# EAGLE design robo_mantis (EAGLE 9.2.2)
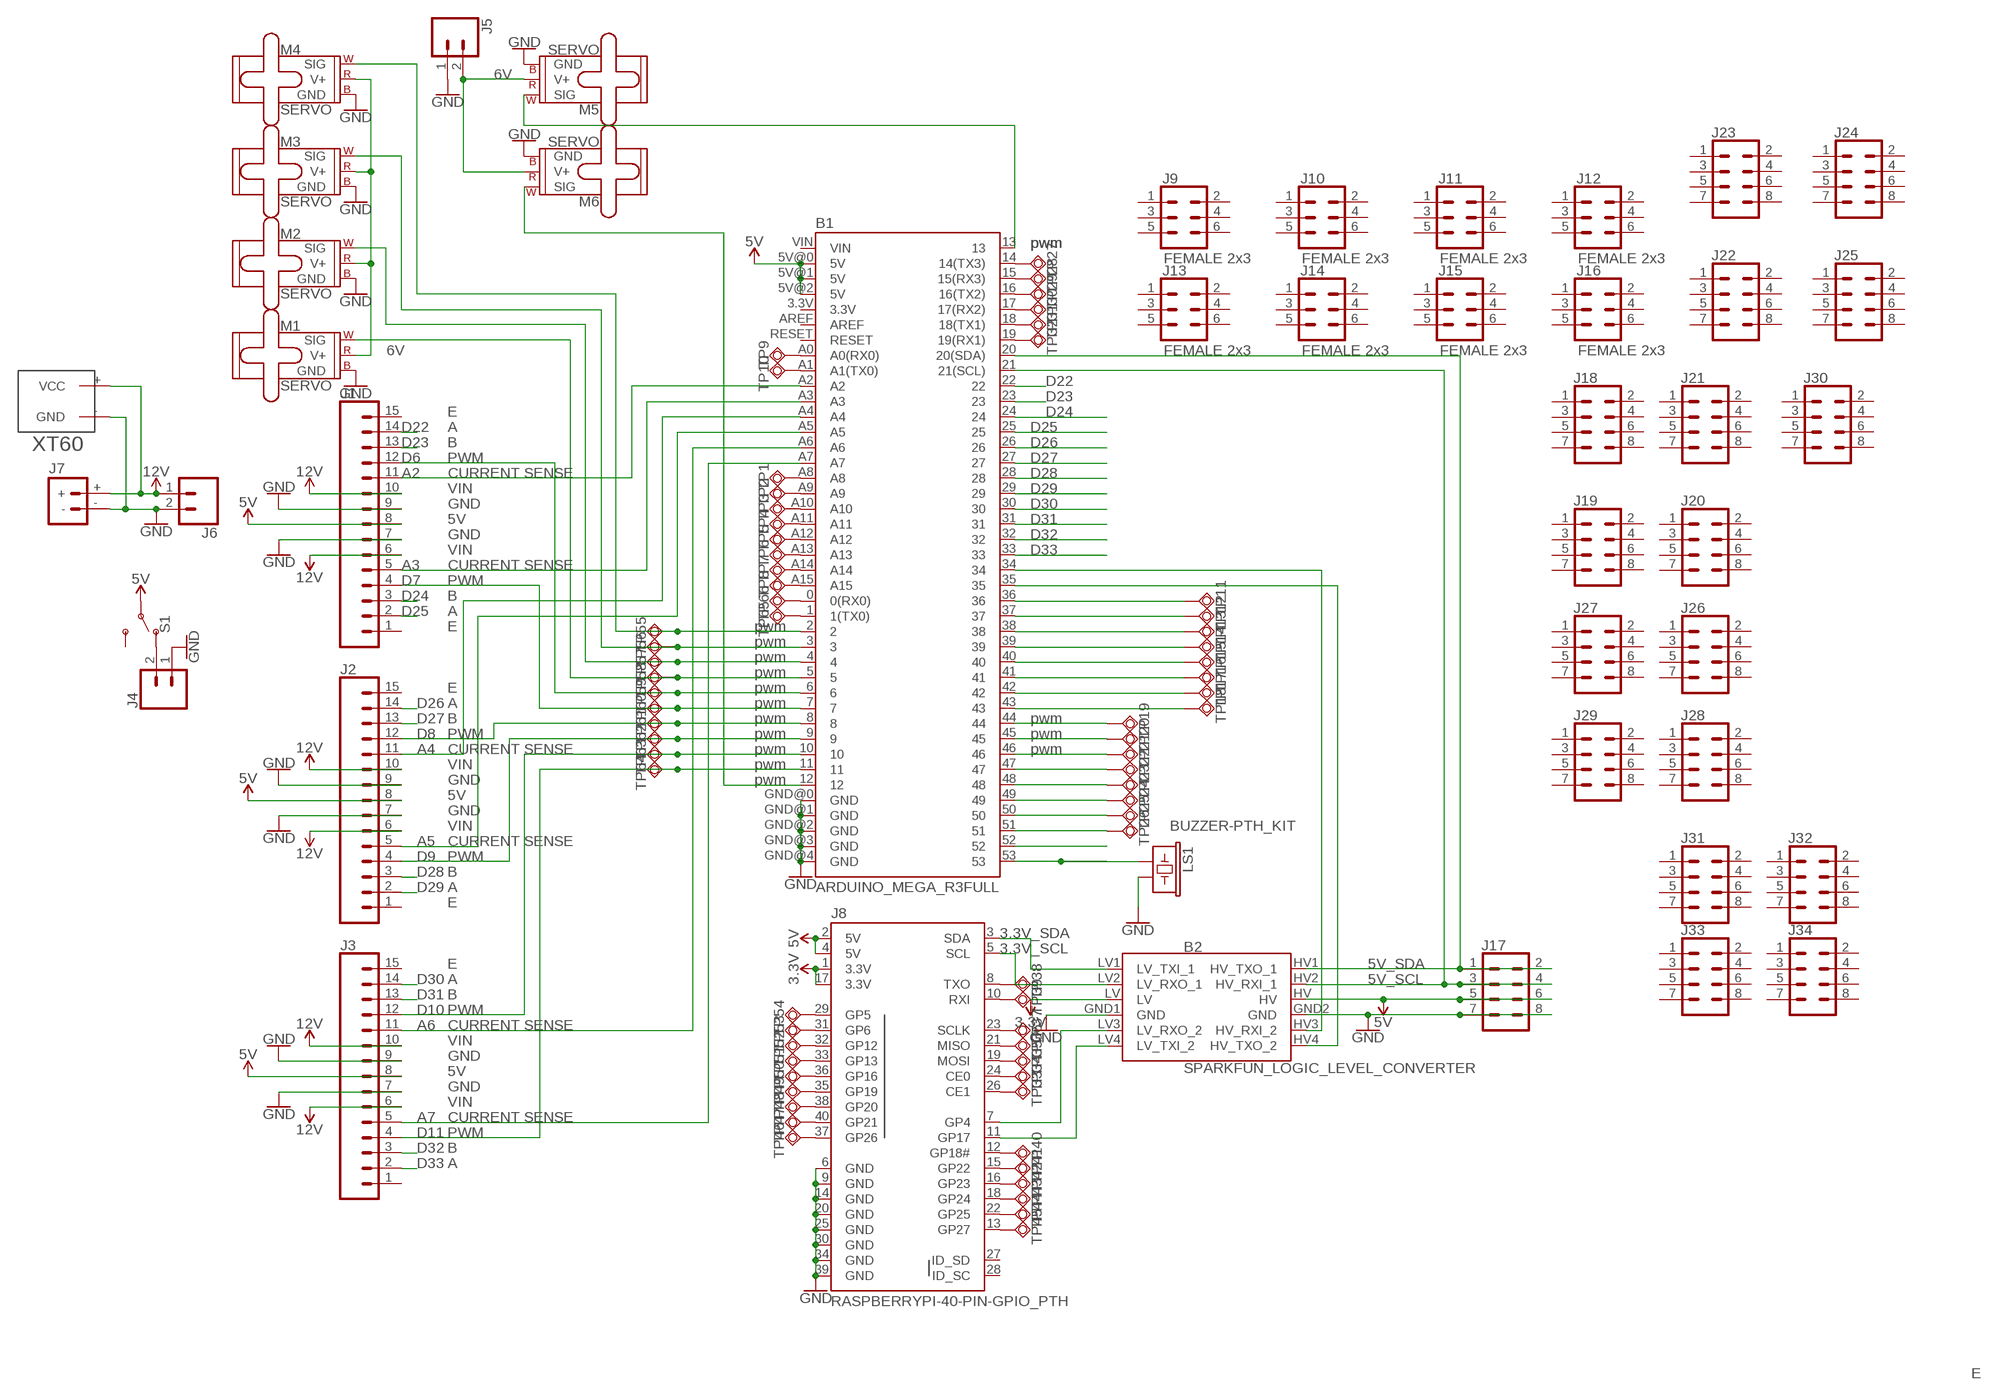
[diagram p0: schematic, sheet 1]

## Parts
B1  ARDUINO_MEGA_R3FULL  [ARDUINO_MEGA]
B2  SPARKFUN_LOGIC_LEVEL_CONVERTER  [SPARKFUN_LOGIC_LEVEL_CONVERTER]
J1  CONN_15LOCK_LONGPADS  [1X15_LOCK_LONGPADS]
J2  CONN_15LOCK_LONGPADS  [1X15_LOCK_LONGPADS]
J3  CONN_15LOCK_LONGPADS  [1X15_LOCK_LONGPADS]
J4  CONN_02  [1X02]
J5  CONN_02  [1X02]
J6  CONN_02  [1X02]
J7  BATTERY_CONN_DEANS  [DEANS]
J8  RASPBERRYPI-40-PIN-GPIO_PTH  [2X20_SHROUDED]
J9  FEMALE 2x3  CONN_03X2FEMALE  [2X3]
J10  FEMALE 2x3  CONN_03X2FEMALE  [2X3]
J11  FEMALE 2x3  CONN_03X2FEMALE  [2X3]
J12  FEMALE 2x3  CONN_03X2FEMALE  [2X3]
J13  FEMALE 2x3  CONN_03X2FEMALE  [2X3]
J14  FEMALE 2x3  CONN_03X2FEMALE  [2X3]
J15  FEMALE 2x3  CONN_03X2FEMALE  [2X3]
J16  FEMALE 2x3  CONN_03X2FEMALE  [2X3]
J17  CONN_04X2  [2X4]
J18  CONN_04X2  [2X4]
J19  CONN_04X2  [2X4]
J20  CONN_04X2  [2X4]
J21  CONN_04X2  [2X4]
J22  CONN_04X2  [2X4]
J23  CONN_04X2  [2X4]
J24  CONN_04X2  [2X4]
J25  CONN_04X2  [2X4]
J26  CONN_04X2  [2X4]
J27  CONN_04X2  [2X4]
J28  CONN_04X2  [2X4]
J29  CONN_04X2  [2X4]
J30  CONN_04X2  [2X4]
J31  CONN_04X2  [2X4]
J32  CONN_04X2  [2X4]
J33  CONN_04X2  [2X4]
J34  CONN_04X2  [2X4]
LS1  BUZZER-PTH_KIT  [BUZZER-12MM-KIT]
M1  SERVO  [1X03]
M2  SERVO  [1X03]
M3  SERVO  [1X03]
M4  SERVO  [1X03]
M5  SERVO  [1X03]
M6  SERVO  [1X03]
S1  SWITCH-SPDT-PTH-11.6X4.0MM-LOCK  [SWITCH_SPDT_PTH_11.6X4.0MM_LOCK]
TP1  TESTPAD_TPSQB1,27  [TESTPAD_B1,27]
TP2  TESTPAD_TPSQB1,27  [TESTPAD_B1,27]
TP3  TESTPAD_TPSQB1,27  [TESTPAD_B1,27]
TP4  TESTPAD_TPSQB1,27  [TESTPAD_B1,27]
TP5  TESTPAD_TPSQB1,27  [TESTPAD_B1,27]
TP6  TESTPAD_TPSQB1,27  [TESTPAD_B1,27]
TP7  TESTPAD_TPSQB1,27  [TESTPAD_B1,27]
TP8  TESTPAD_TPSQB1,27  [TESTPAD_B1,27]
TP9  TESTPAD_TPSQB1,27  [TESTPAD_B1,27]
TP10  TESTPAD_TPSQB1,27  [TESTPAD_B1,27]
TP11  TESTPAD_TPSQB1,27  [TESTPAD_B1,27]
TP12  TESTPAD_TPSQB1,27  [TESTPAD_B1,27]
TP13  TESTPAD_TPSQB1,27  [TESTPAD_B1,27]
TP14  TESTPAD_TPSQB1,27  [TESTPAD_B1,27]
TP15  TESTPAD_TPSQB1,27  [TESTPAD_B1,27]
TP16  TESTPAD_TPSQB1,27  [TESTPAD_B1,27]
TP17  TESTPAD_TPSQB1,27  [TESTPAD_B1,27]
TP18  TESTPAD_TPSQB1,27  [TESTPAD_B1,27]
TP19  TESTPAD_TPSQB1,27  [TESTPAD_B1,27]
TP20  TESTPAD_TPSQB1,27  [TESTPAD_B1,27]
TP21  TESTPAD_TPSQB1,27  [TESTPAD_B1,27]
TP22  TESTPAD_TPSQB1,27  [TESTPAD_B1,27]
TP23  TESTPAD_TPSQB1,27  [TESTPAD_B1,27]
TP24  TESTPAD_TPSQB1,27  [TESTPAD_B1,27]
TP25  TESTPAD_TPSQB1,27  [TESTPAD_B1,27]
TP26  TESTPAD_TPSQB1,27  [TESTPAD_B1,27]
TP27  TESTPAD_TPSQB1,27  [TESTPAD_B1,27]
TP28  TESTPAD_TPSQB1,27  [TESTPAD_B1,27]
TP29  TESTPAD_TPSQB1,27  [TESTPAD_B1,27]
TP30  TESTPAD_TPSQB1,27  [TESTPAD_B1,27]
TP31  TESTPAD_TPSQB1,27  [TESTPAD_B1,27]
TP32  TESTPAD_TPSQB1,27  [TESTPAD_B1,27]
TP33  TESTPAD_TPSQB1,27  [TESTPAD_B1,27]
TP34  TESTPAD_TPSQB1,27  [TESTPAD_B1,27]
TP35  TESTPAD_TPSQB1,27  [TESTPAD_B1,27]
TP36  TESTPAD_TPSQB1,27  [TESTPAD_B1,27]
TP37  TESTPAD_TPSQB1,27  [TESTPAD_B1,27]
TP38  TESTPAD_TPSQB1,27  [TESTPAD_B1,27]
TP39  TESTPAD_TPSQB1,27  [TESTPAD_B1,27]
TP40  TESTPAD_TPSQB1,27  [TESTPAD_B1,27]
TP41  TESTPAD_TPSQB1,27  [TESTPAD_B1,27]
TP42  TESTPAD_TPSQB1,27  [TESTPAD_B1,27]
TP43  TESTPAD_TPSQB1,27  [TESTPAD_B1,27]
TP44  TESTPAD_TPSQB1,27  [TESTPAD_B1,27]
TP45  TESTPAD_TPSQB1,27  [TESTPAD_B1,27]
TP46  TESTPAD_TPSQB1,27  [TESTPAD_B1,27]
TP47  TESTPAD_TPSQB1,27  [TESTPAD_B1,27]
TP48  TESTPAD_TPSQB1,27  [TESTPAD_B1,27]
TP49  TESTPAD_TPSQB1,27  [TESTPAD_B1,27]
TP50  TESTPAD_TPSQB1,27  [TESTPAD_B1,27]
TP51  TESTPAD_TPSQB1,27  [TESTPAD_B1,27]
TP52  TESTPAD_TPSQB1,27  [TESTPAD_B1,27]
TP53  TESTPAD_TPSQB1,27  [TESTPAD_B1,27]
TP54  TESTPAD_TPSQB1,27  [TESTPAD_B1,27]
TP55  TESTPAD_TPSQB1,27  [TESTPAD_B1,27]
TP56  TESTPAD_TPSQB1,27  [TESTPAD_B1,27]
TP57  TESTPAD_TPSQB1,27  [TESTPAD_B1,27]
TP58  TESTPAD_TPSQB1,27  [TESTPAD_B1,27]
TP59  TESTPAD_TPSQB1,27  [TESTPAD_B1,27]
TP60  TESTPAD_TPSQB1,27  [TESTPAD_B1,27]
TP61  TESTPAD_TPSQB1,27  [TESTPAD_B1,27]
TP62  TESTPAD_TPSQB1,27  [TESTPAD_B1,27]
TP63  TESTPAD_TPSQB1,27  [TESTPAD_B1,27]
TP64  TESTPAD_TPSQB1,27  [TESTPAD_B1,27]
TP65  TESTPAD_TPSQB1,27  [TESTPAD_B1,27]
TP66  TESTPAD_TPSQB1,27  [TESTPAD_B1,27]
U$1  XT60  [XT60]

## Nets
3.3V: B2.LV J8.1(3.3V) J8.17(3.3V)
3.3V_SCL: B2.LV2(LV_RXO_1) J8.5(SCL)
3.3V_SDA: B2.LV1(LV_TXI_1) J8.3(SDA)
5V: B1.5V@0(5V) B1.5V@1(5V) B1.5V@2(5V) B2.HV J1.8 J2.8 J3.8 J8.2(5V) J8.4(5V) J17.5 J17.6 S1.2(P)
5V_SCL: B1.21(21(SCL)) B2.HV2(HV_RXI_1) J17.3 J17.4
5V_SDA: B1.20(20(SDA)) B2.HV1(HV_TXO_1) J17.1 J17.2
6V: J5.2 M1.2(V+) M2.2(V+) M3.2(V+) M4.2(V+) M5.2(V+) M6.2(V+)
12V: J1.6 J1.10 J2.6 J2.10 J3.6 J3.10 J6.1 J7.+ U$1.+(VCC)
A2: B1.A2 J1.11
A3: B1.A3 J1.5
A4: B1.A4 J2.11
A5: B1.A5 J2.5
A6: B1.A6 J3.11
A7: B1.A7 J3.5
BCM4: B2.LV3(LV_RXO_2) J8.7(GP4)
BCM17: B2.LV4(LV_TXI_2) J8.11(GP17)
D2: B1.2 M4.1(SIG) TP55.TP
D3: B1.3 M3.1(SIG) TP56.TP
D4: B1.4 M2.1(SIG) TP57.TP
D5: B1.5 M1.1(SIG) TP58.TP
D6: B1.6 J1.12 TP59.TP
D7: B1.7 J1.4 TP60.TP
D8: B1.8 J2.12 TP61.TP
D9: B1.9 J2.4 TP62.TP
D10: B1.10 J3.12 TP63.TP
D11: B1.11 J3.4 TP64.TP
D12: B1.12 M6.1(SIG)
D13: B1.13 M5.1(SIG)
D22: B1.22 J1.14
D23: B1.23 J1.13
D24: B1.24 J1.3
D25: B1.25 J1.2
D26: B1.26 J2.14
D27: B1.27 J2.13
D28: B1.28 J2.3
D29: B1.29 J2.2
D30: B1.30 J3.14
D31: B1.31 J3.13
D32: B1.32 J3.3
D33: B1.33 J3.2
GND: B1.GND@0(GND) B1.GND@1(GND) B1.GND@2(GND) B1.GND@3(GND) B1.GND@4(GND) B2.GND1(GND) B2.GND2(GND) J1.7 J1.9 J2.7 J2.9 J3.7 J3.9 J4.1 J5.1 J6.2 J7.- J8.6(GND) J8.9(GND) J8.14(GND) J8.20(GND) J8.25(GND) J8.30(GND) J8.34(GND) J8.39(GND) J17.7 J17.8 LS1.- M1.3(GND) M2.3(GND) M3.3(GND) M4.3(GND) M5.3(GND) M6.3(GND) U$1.-(GND)
N$5: B1.44 TP19.TP
N$6: B1.45 TP20.TP
N$8: B1.46 TP21.TP
N$9: B1.47 TP22.TP
N$11: B1.48 TP23.TP
N$12: B1.49 TP24.TP
N$14: B1.50 TP25.TP
N$15: B1.51 TP26.TP
N$17: B1.52
N$18: B1.53 LS1.+
N$23: J4.2 S1.1(O)
N$26: B1.A8 TP1.TP
N$27: B1.A9 TP2.TP
N$28: B1.A10 TP3.TP
N$30: B1.A11 TP4.TP
N$31: B1.A12 TP5.TP
N$33: B1.A13 TP6.TP
N$34: B1.A14 TP7.TP
N$35: B1.34 B2.HV3(HV_RXI_2)
N$36: B1.35 B2.HV4(HV_TXO_2)
N$37: B1.36 TP11.TP
N$38: B1.37 TP12.TP
N$39: B1.38 TP13.TP
N$40: B1.39 TP14.TP
N$41: B1.40 TP15.TP
N$42: B1.41 TP16.TP
N$43: B1.42 TP17.TP
N$44: B1.43 TP18.TP
N$53: B1.A15 TP8.TP
N$54: B1.A0(A0(RX0)) TP9.TP
N$55: B1.A1(A1(TX0)) TP10.TP
N$56: B1.14(14(TX3)) TP27.TP
N$57: B1.15(15(RX3)) TP28.TP
N$58: B1.16(16(TX2)) TP29.TP
N$59: B1.17(17(RX2)) TP30.TP
N$60: B1.18(18(TX1)) TP31.TP
N$61: B1.19(19(RX1)) TP32.TP
N$62: J8.26(CE1) TP33.TP
N$63: J8.24(CE0) TP34.TP
N$64: J8.19(MOSI) TP35.TP
N$65: J8.21(MISO) TP36.TP
N$66: J8.23(SCLK) TP37.TP
N$67: J8.8(TXO) TP38.TP
N$68: J8.10(RXI) TP39.TP
N$69: J8.12(GP18#) TP40.TP
N$70: J8.15(GP22) TP41.TP
N$71: J8.16(GP23) TP42.TP
N$72: J8.18(GP24) TP43.TP
N$73: J8.22(GP25) TP44.TP
N$74: J8.13(GP27) TP45.TP
N$75: J8.37(GP26) TP46.TP
N$76: J8.40(GP21) TP47.TP
N$77: J8.38(GP20) TP48.TP
N$78: J8.35(GP19) TP49.TP
N$79: J8.36(GP16) TP50.TP
N$80: J8.33(GP13) TP51.TP
N$81: J8.32(GP12) TP52.TP
N$82: J8.31(GP6) TP53.TP
N$83: J8.29(GP5) TP54.TP
N$84: B1.1(1(TX0)) TP65.TP
N$85: B1.0(0(RX0)) TP66.TP
Unconnected: B1.3.3V B1.AREF B1.RESET B1.VIN J1.1 J1.15 J2.1 J2.15 J3.1 J3.15 J8.27(ID_SD) J8.28(ID_SC) J9.1 J9.2 J9.3 J9.4 J9.5 J9.6 J10.1 J10.2 J10.3 J10.4 J10.5 J10.6 J11.1 J11.2 J11.3 J11.4 J11.5 J11.6 J12.1 J12.2 J12.3 J12.4 J12.5 J12.6 J13.1 J13.2 J13.3 J13.4 J13.5 J13.6 J14.1 J14.2 J14.3 J14.4 J14.5 J14.6 J15.1 J15.2 J15.3 J15.4 J15.5 J15.6 J16.1 J16.2 J16.3 J16.4 J16.5 J16.6 J18.1 J18.2 J18.3 J18.4 J18.5 J18.6 J18.7 J18.8 J19.1 J19.2 J19.3 J19.4 J19.5 J19.6 J19.7 J19.8 J20.1 J20.2 J20.3 J20.4 J20.5 J20.6 J20.7 J20.8 J21.1 J21.2 J21.3 J21.4 J21.5 J21.6 J21.7 J21.8 J22.1 J22.2 J22.3 J22.4 J22.5 J22.6 J22.7 J22.8 J23.1 J23.2 J23.3 J23.4 J23.5 J23.6 J23.7 J23.8 J24.1 J24.2 J24.3 J24.4 J24.5 J24.6 J24.7 J24.8 J25.1 J25.2 J25.3 J25.4 J25.5 J25.6 J25.7 J25.8 J26.1 J26.2 J26.3 J26.4 J26.5 J26.6 J26.7 J26.8 J27.1 J27.2 J27.3 J27.4 J27.5 J27.6 J27.7 J27.8 J28.1 J28.2 J28.3 J28.4 J28.5 J28.6 J28.7 J28.8 J29.1 J29.2 J29.3 J29.4 J29.5 J29.6 J29.7 J29.8 J30.1 J30.2 J30.3 J30.4 J30.5 J30.6 J30.7 J30.8 J31.1 J31.2 J31.3 J31.4 J31.5 J31.6 J31.7 J31.8 J32.1 J32.2 J32.3 J32.4 J32.5 J32.6 J32.7 J32.8 J33.1 J33.2 J33.3 J33.4 J33.5 J33.6 J33.7 J33.8 J34.1 J34.2 J34.3 J34.4 J34.5 J34.6 J34.7 J34.8 S1.3(S)

## Notes on the sheet
- pwm | pwm
- E
- A
- B
- PWM
- CURRENT SENSE
- VIN
- GND
- 5V
- GND
- VIN
- CURRENT SENSE
- PWM
- B
- A
- E | pwm
- pwm
- pwm
- pwm
- E | pwm
- A | pwm
- B | pwm | pwm
- PWM | pwm | pwm
- CURRENT SENSE | pwm | pwm
- VIN | pwm
- GND | pwm
- 5V
- GND
- VIN
- CURRENT SENSE
- PWM
- B
- A
- E
- E
- A
- B
- PWM
- CURRENT SENSE
- VIN
- GND
- 5V
- GND
- VIN
- CURRENT SENSE
- PWM
- B
- A
- E

## Library data of the parts
B1 = SparkFun-Boards:ARDUINO_MEGA_R3: Arduino Mega R3 ATmega2560 R3 compatible footprint. SparkFun Products: Arduino Mega 2560 R3 <https://www.sparkfun.com/products/11061>
B2 = SparkFun-Boards:SPARKFUN_LOGIC_LEVEL_CONVERTER: SparkFun Logic Level Converter -Bi-Directional This is the mechnical outline for the 3.3V - 5V bi directional logic level converter. *Note, the "LOCK" Package has the header pins staggered by an offset of 5 mils (off center line), so that when you slide a row of standard 0.1" headers into the PTH pads, it will hold position vertically. See the follwing turorial for more information on this type of special footprints: Sneaky Footprints <https://www.sparkfun.com/tutorials/114> SparkFun Products: SparkFun Logic Level Converter - Bi-Directional <https://www.sparkfun.com/products/12009>
J1-J3 = SparkFun-Connectors:CONN_15: Multi connection point. Often used as Generic Header-pin footprint for 0.1 inch spaced/style header connections On any of the 0.1 inch spaced packages, you can populate with these: Break Away Headers - Straight <https://www.sparkfun.com/products/116> (PRT-00116) Break Away Male Headers - Right Angle <https://www.sparkfun.com/products/553> (PRT-00553) Female Headers <https://www.sparkfun.com/products/115> (PRT-00115) Break Away Headers - Machine Pin <https://www.sparkfun.com/products/117> (PRT-00117) Break Away Female Headers - Swiss Machine Pin <https://www.sparkfun.com/products/743> (PRT-00743) For SCREWTERMINALS and SPRING TERMINALS visit here: Screw Terimnals on SparkFun.com <https://www.sparkfun.com/search/results?term=Screw+Terminals> (5mm/3.5mm/2.54mm spacing) This device is also useful as a general connection point to wire up your design to another part of your project. Our various solder wires solder well into these plated through hole pads. Hook-Up Wire - Assortment (Stranded, 22 AWG) <https://www.sparkfun.com/products/11375> (PRT-11375) Hook-Up Wire - Assortment (Solid Core, 22 AWG) <https://www.sparkfun.com/products/11367> (PRT-11367) View the entire wire category on our website here <https://www.sparkfun.com/categories/141> Special notes: Molex polarized connector foot print use with SKU : PRT-08231 with associated crimp pins and housings. 1MM SMD Version SKU: PRT-10208 NOTES ON THE VARIANTS LOCK and LOCK_LONGPADS... This footprint was designed to help hold the alignment of a through-hole component (i.e. 6-pin header) while soldering it into place. You may notice that each hole has been shifted either up or down by 0.005 of an inch from it's more standard position (which is a perfectly straight line). This slight alteration caused the pins (the squares in the middle) to touch the edges of the holes. Because they are alternating, it causes a "brace" to hold the component in place. 0.005 has proven to be the perfect amount of "off-center" position when using our standard breakaway headers. Although looks a little odd when you look at the bare footprint, once you have a header in there, the alteration is very hard to notice. Also,if you push a header all the way into place, it is covered up entirely on the bottom side.
J4-J6 = SparkFun-Connectors:CONN_02: Multi connection point. Often used as Generic Header-pin footprint for 0.1 inch spaced/style header connections On any of the 0.1 inch spaced packages, you can populate with these: Break Away Headers - Straight <https://www.sparkfun.com/products/116> (PRT-00116) Break Away Male Headers - Right Angle <https://www.sparkfun.com/products/553> (PRT-00553) Female Headers <https://www.sparkfun.com/products/115> (PRT-00115) Break Away Headers - Machine Pin <https://www.sparkfun.com/products/117> (PRT-00117) Break Away Female Headers - Swiss Machine Pin <https://www.sparkfun.com/products/743> (PRT-00743) For SCREWTERMINALS and SPRING TERMINALS visit here: Screw Terimnals on SparkFun.com <https://www.sparkfun.com/search/results?term=Screw+Terminals> (5mm/3.5mm/2.54mm spacing) This device is also useful as a general connection point to wire up your design to another part of your project. Our various solder wires solder well into these plated through hole pads. Hook-Up Wire - Assortment (Stranded, 22 AWG) <https://www.sparkfun.com/products/11375> (PRT-11375) Hook-Up Wire - Assortment (Solid Core, 22 AWG) <https://www.sparkfun.com/products/11367> (PRT-11367) View the entire wire category on our website here <https://www.sparkfun.com/categories/141> Special notes: Molex polarized connector foot print use with: PRT-08233 with associated crimp pins and housings. 2.54_SCREWTERM for use with PRT-10571. 3.5mm Screw Terminal footprints for PRT-08084 5mm Screw Terminal footprints for use with PRT-08432
J7 = SparkFun-Connectors:BATTERY_CONN: Battery Connectors Various footprints for battery connections SparkFun Products: Deans Connector -M/F Pair <https://www.sparkfun.com/products/11864>; SF_ID: PRT-11864
J8 = SparkFun-Connectors:RASPBERRYPI-40-PIN-GPIO: Raspberry Pi GPIO Header 2x20 pin connector, as found on B, B+, A+ models. Both shrouded PTH and SMT versions available. SparkFun Products: GPIO Shrouded Header <https://www.sparkfun.com/products/13054>- PTH SparkFun Pi Wedge (Preassembled) <https://www.sparkfun.com/products/13717>; PROD_ID: CONN-12263; SF_ID: PRT-13054
J9-J16 = SparkFun-Connectors:CONN_03X2: Multi connection point. Often used as Generic Header-pin footprint for 0.1 inch spaced/style header connections You can populate with any combo of single row headers, but if you'd like an exact match, check these: Header - 2x3 (Male, 0.1") <https://www.sparkfun.com/products/12807> (PRT-12807) Header - 2x3 (Female, 0.1") <https://www.sparkfun.com/products/13010> (PRT-13010) 2x3 Pin Shrouded Header <https://www.sparkfun.com/products/10877> (PRT-10877) On any of the 0.1 inch spaced packages, you can populate with these: Break Away Headers - Straight <https://www.sparkfun.com/products/116> (PRT-00116) Break Away Male Headers - Right Angle <https://www.sparkfun.com/products/553> (PRT-00553) Female Headers <https://www.sparkfun.com/products/115> (PRT-00115) Break Away Headers - Machine Pin <https://www.sparkfun.com/products/117> (PRT-00117) Break Away Female Headers - Swiss Machine Pin <https://www.sparkfun.com/products/743> (PRT-00743) Special note: the shrouded connector mates well with our 3x2 ribbon cables: Ribbon Crimp Connector - 6-pin (2x3, Female) <https://www.sparkfun.com/products/10651> (PRT-10651) Ribbon Cable - 6 wire (15ft) <https://www.sparkfun.com/products/10646> (PRT-10646); PROD_ID: CONN-11566
J17-J34 = SparkFun-Connectors:CONN_04X2: Multi connection point. Often used as Generic Header-pin footprint for 0.1 inch spaced/style header connections On any of the 0.1 inch spaced packages, you can populate with these: Break Away Headers - Straight <https://www.sparkfun.com/products/116> (PRT-00116) Break Away Male Headers - Right Angle <https://www.sparkfun.com/products/553> (PRT-00553) Female Headers <https://www.sparkfun.com/products/115> (PRT-00115) Break Away Headers - Machine Pin <https://www.sparkfun.com/products/117> (PRT-00117) Break Away Female Headers - Swiss Machine Pin <https://www.sparkfun.com/products/743> (PRT-00743)
LS1 = SparkFun-Electromechanical:BUZZER: Buzzer Small round buzzers that operate around the audible 2kHz range. You can use these as speakers to create simple music or user interfaces. Variant Overview: PTH - Mini Speaker - PC Mount 12mm 2.048kHz <https://www.sparkfun.com/products/7950> PTH_KIT - Mini Speaker - PC Mount 12mm 2.048kHz <https://www.sparkfun.com/products/7950> KIT simplifies soldering by adding stop mask to one side of the pads. PTH_NO_SILK - Mini Speaker - PC Mount 12mm 2.048kHz <https://www.sparkfun.com/products/7950> No silkscreen indicator of buzzer outline. PTH_KIT_NO_SILK - Mini Speaker - PC Mount 12mm 2.048kHz <https://www.sparkfun.com/products/7950> KIT package w/o silkscreen SMD - Buzzer Audio Magnetic (CCV-084B16) SMD buzzer used on, e.g. the LilyPad Buzzer <https://www.sparkfun.com/products/8463> and RFID USB Reader <https://www.sparkfun.com/products/9963>. SMD_KIT - Buzzer Audio Magnetic (CCV-084B16) SMD Buzzer with elongated pins to make soldering easier. Used on the SparkFun Simon Says - Surface Mount Soldering Kit <https://www.sparkfun.com/products/10935>.; PROD_ID: COMP-08253; SF_SKU: COM-07950
M1-M6 = SparkFun-Electromechanical:SERVO: Servo Motor 3-pin connector for a standard servo motor (voltage supply, ground, and control signal.) SparkFun Products Servo - Generic (Sub-Micro Size) <https://www.sparkfun.com/products/9065> (ROB-09065) Servo - Generic High Torque Continuous Rotation (Standard Size) <https://www.sparkfun.com/products/9347> (ROB-09347) Servo - Generic High Torque (Standard Size) <https://www.sparkfun.com/products/11965> (ROB-11965)
S1 = SparkFun-Switches:SWITCH-SPDT: Single Pole, Double Throw (SPDT) Switch Single-pole, double-throw (SPDT) switch. Variant Overview SMD-AYZ0202 Surface Mount DPDT Switch <https://www.sparkfun.com/products/597> (COM-00597) Used on e.g. LilyPad Arduino USB - ATmega32U4 Board <https://www.sparkfun.com/products/12049> PTH-11.6X4.0MM SPDT Mini Power Switch <https://www.sparkfun.com/products/102> (COM-00102) Used on e.g. SparkFun Simon Says - Through-Hole Soldering Kit <https://www.sparkfun.com/products/10547> (KIT-10547) PTH-11.6X4.0MM-KIT KIT version of SPDT Mini Power Switch - Simplifies soldering by removing tStop of switch pins - only one side can be soldered. PTH-11.6X4.0MM-LOCK LOCK version of SPDT Mini Power Switch - Offset pins hold switch in place for easier soldering. SMD-RIGHT-ANGLE Surface Mount Right Angle Switch <https://www.sparkfun.com/products/10860> (COM-10860) Used on e.g. SparkFun ESP8266 Thing <https://www.sparkfun.com/products/13231>; PROD_ID: SWCH-08261; SF_SKU: COM-00102
TP1-TP66 = BeagleBone_Blue_R3:TESTPAD_TPSQ: Test pad
U$1 = XT60:XT60: XT60

## Board
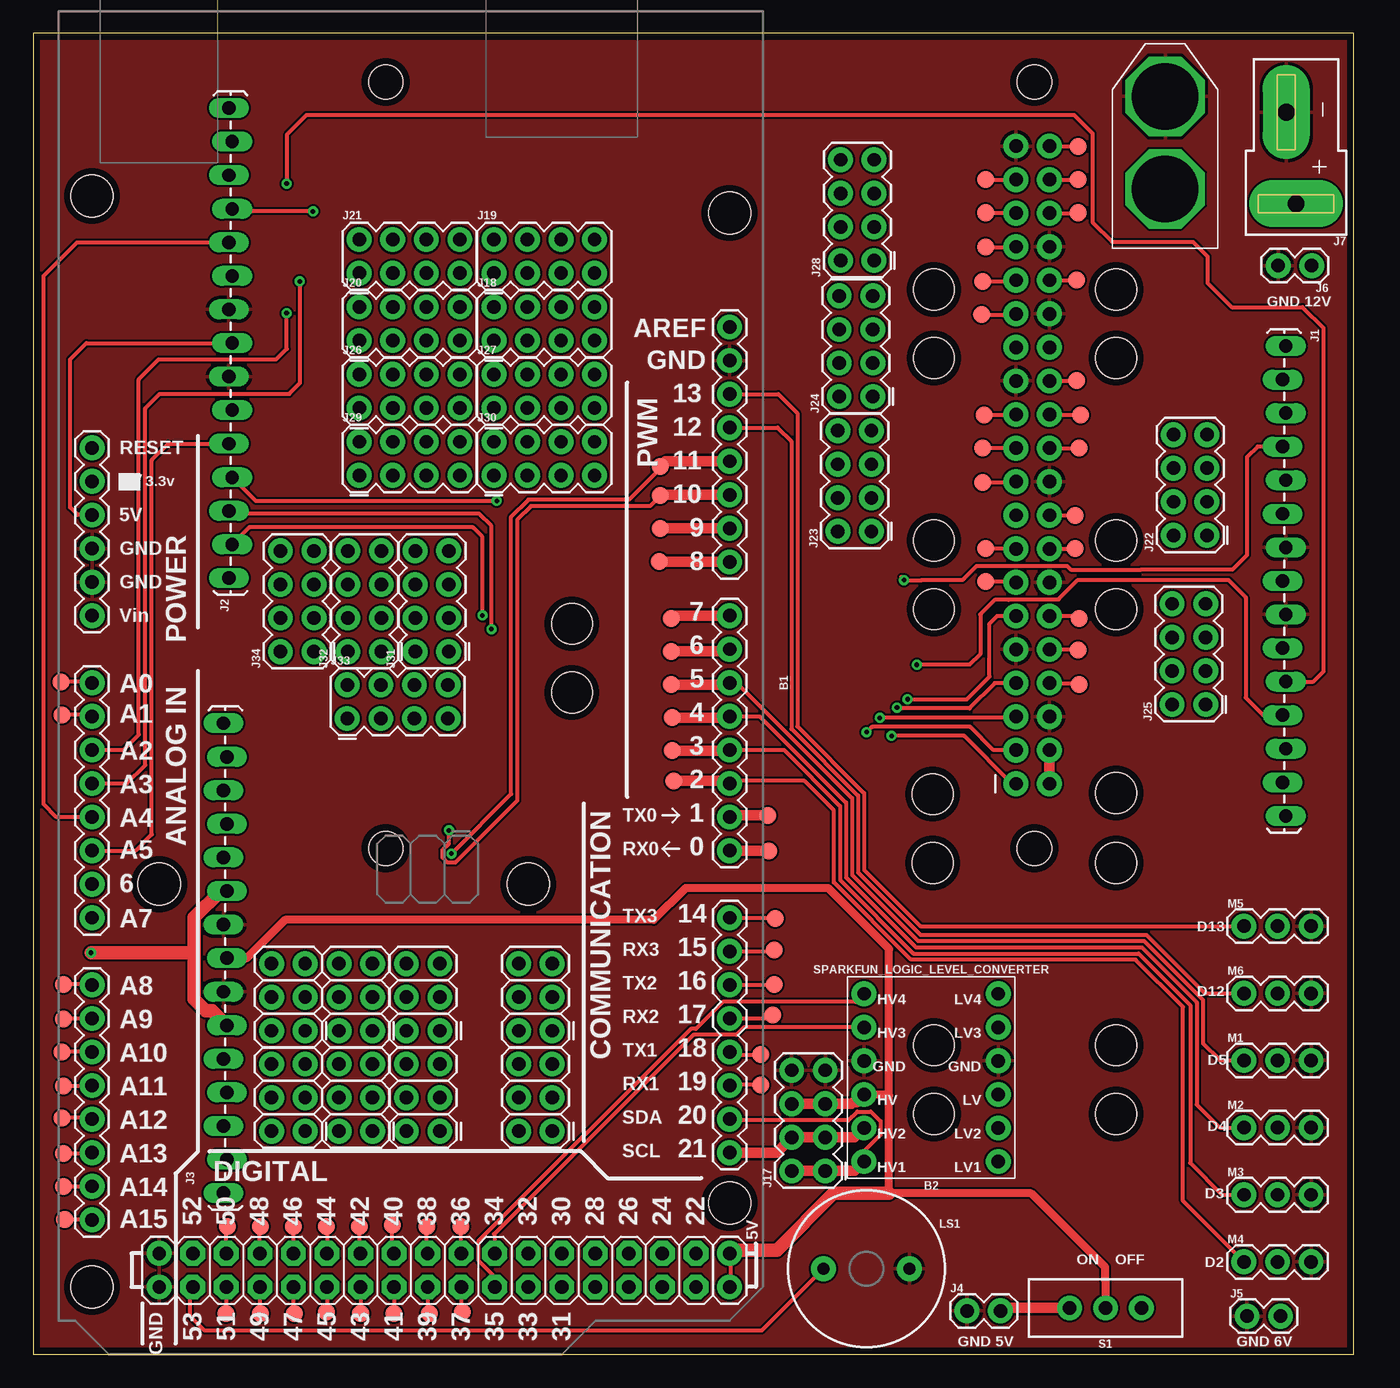
[diagram p1: board, top side]
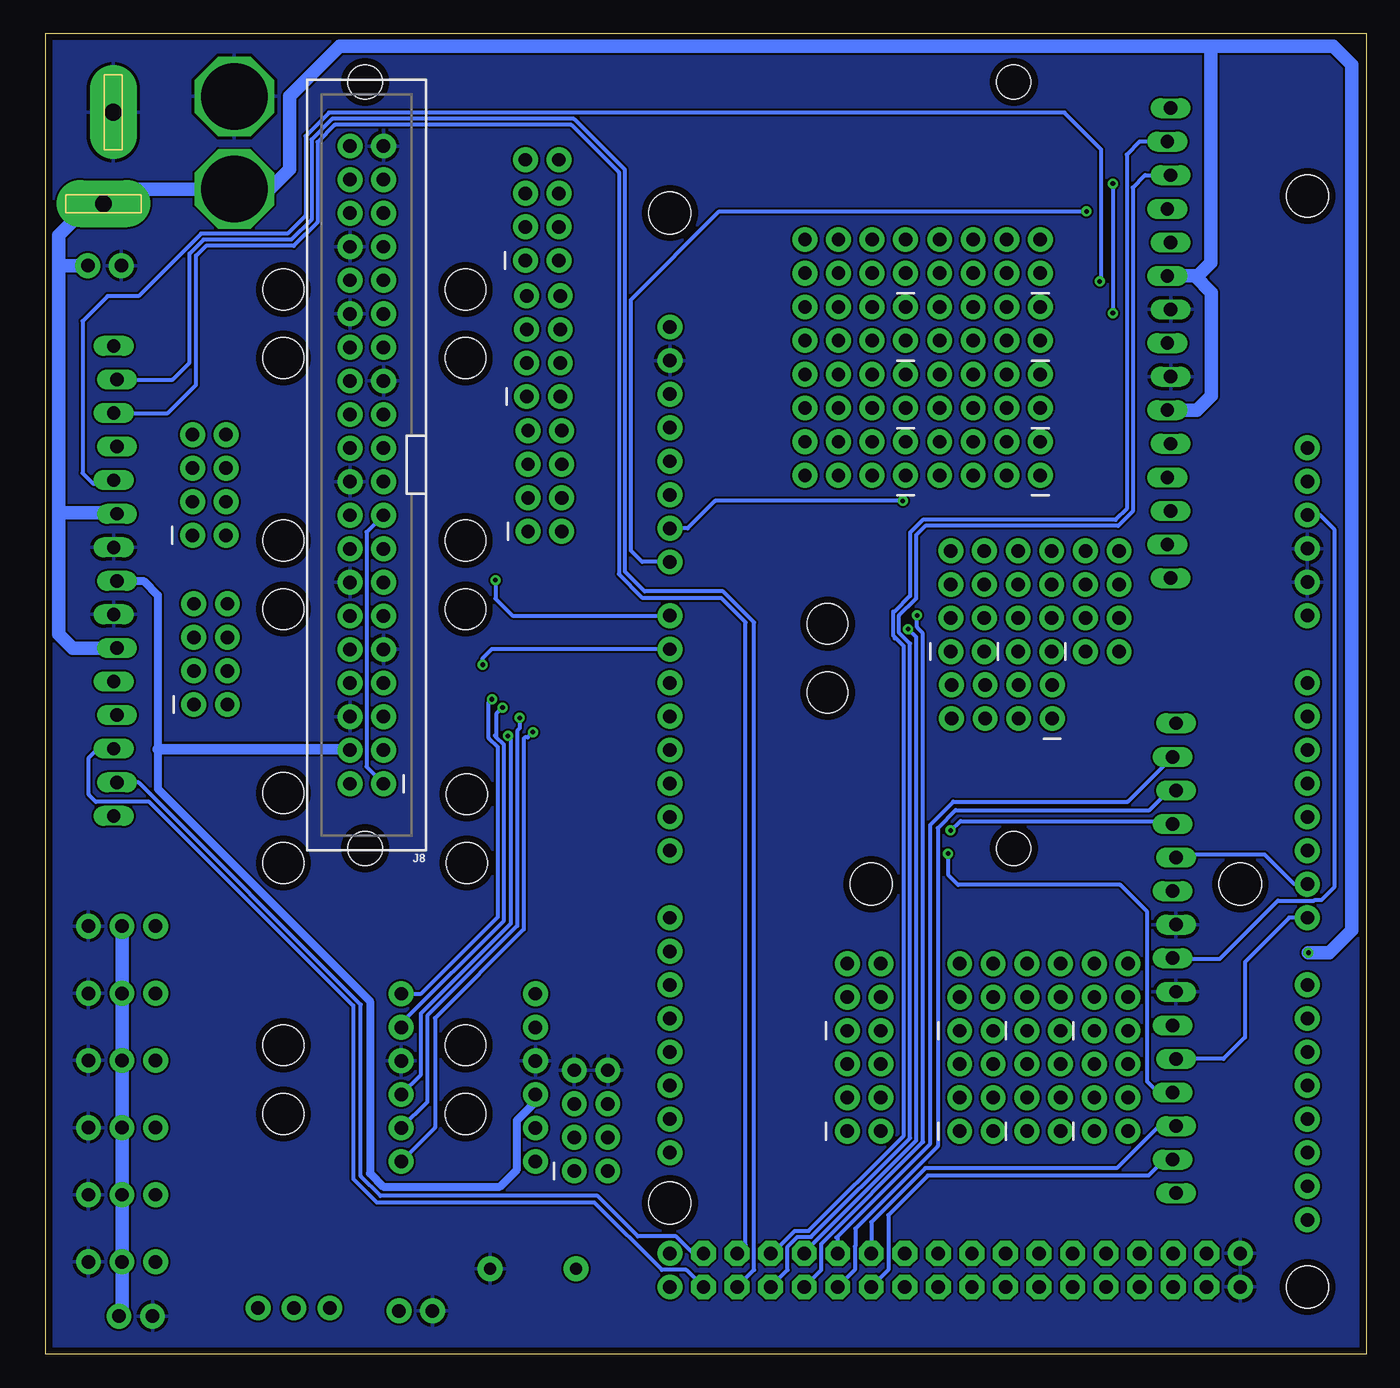
[diagram p2: board, bottom side, seen from below]

Size 100 x 100 mm. Coordinates in mm from the lower left corner, seen from the top.
Outline: 0,0 100,0 100,100 0,100 0,0
Copper layers (1*16): Top 0.035mm / dielectric 1.5mm / Bottom 0.035mm
Design rules "default *": minimum track width 12mil, minimum drill 0.35mm, track to track 6mil, track to pad 6mil, pad to pad 6mil, via to via 6mil, smd to smd 6mil, copper to edge 20mil, drill to drill 6mil, minimum pad ring 10mil, minimum via ring 8mil, stop-mask expansion 4mil, vias tented up to drill 0mil, thermal gap 10mil
Holes 3.1 mm at 68.2,80.6 68.2,75.4 68.2,61.6 68.2,56.4 82,80.6 82,75.4 82,61.6 82,56.4 82,18.2 82,23.4 68.2,23.4 68.2,18.2 68.1,42.4 68.1,37.2 82,42.5 82,37.2 40.8,55.3 40.8,50.1
Holes 2.6 mm at 75.8,96.3 75.8,38.3 26.7,38.3 26.7,96.3

### Footprints (pad centres in the part's own frame; a part is rotated, then mirrored left to right if it is on the bottom)
ARDUINO_MEGA = drill 1.016 pad 1.88: 0 13.97,24.13; 1 11.43,24.13; 2 8.89,24.13; 3 6.35,24.13; 3.3V -13.97,-24.13; 4 3.81,24.13; 5 1.27,24.13; 5V@0 -11.43,-24.13; 5V@1 44.45,24.13; 5V@2 46.99,24.13; 6 -1.27,24.13; 7 -3.81,24.13; 8 -7.874,24.13; 9 -10.414,24.13; 10 -12.954,24.13; 11 -15.494,24.13; 12 -18.034,24.13; 13 -20.574,24.13; 14 19.05,24.13; 15 21.59,24.13; 16 24.13,24.13; 17 26.67,24.13; 18 29.21,24.13; 19 31.75,24.13; 20 34.29,24.13; 21 36.83,24.13; A0 1.27,-24.13; A1 3.81,-24.13; A2 6.35,-24.13; A3 8.89,-24.13; A4 11.43,-24.13; A5 13.97,-24.13; A6 16.51,-24.13; A7 19.05,-24.13; A8 24.13,-24.13; A9 26.67,-24.13; A10 29.21,-24.13; A11 31.75,-24.13; A12 34.29,-24.13; A13 36.83,-24.13; A14 39.37,-24.13; A15 41.91,-24.13; AREF -25.654,24.13; GND@0 -8.89,-24.13; GND@1 -6.35,-24.13; GND@2 44.45,-19.05; GND@3 46.99,-19.05; GND@4 -23.114,24.13; RESET -16.51,-24.13; VIN -3.81,-24.13 | drill 1.016 pad 1.88 octagon: 22 44.45,21.59; 23 46.99,21.59; 24 44.45,19.05; 25 46.99,19.05; 26 44.45,16.51; 27 46.99,16.51; 28 44.45,13.97; 29 46.99,13.97; 30 44.45,11.43; 31 46.99,11.43; 32 44.45,8.89; 33 46.99,8.89; 34 44.45,6.35; 35 46.99,6.35; 36 44.45,3.81; 37 46.99,3.81; 38 44.45,1.27; 39 46.99,1.27; 40 44.45,-1.27; 41 46.99,-1.27; 42 44.45,-3.81; 43 46.99,-3.81; 44 44.45,-6.35; 45 46.99,-6.35; 46 44.45,-8.89; 47 46.99,-8.89; 48 44.45,-11.43; 49 46.99,-11.43; 50 44.45,-13.97; 51 46.99,-13.97; 52 44.45,-16.51; 53 46.99,-16.51 | hole 3.2: -34.29,24.13; -35.56,-24.13; 16.51,8.89; 16.51,-19.05; 40.64,24.13; 46.99,-24.13
SPARKFUN_LOGIC_LEVEL_CONVERTER = drill 1.016 pad 1.88: GND1 -5.08,-1.27; GND2 5.08,-1.27; HV 5.08,1.27; HV1 5.08,6.35; HV2 5.08,3.81; HV3 5.08,-3.81; HV4 5.08,-6.35; LV -5.08,1.27; LV1 -5.08,6.35; LV2 -5.08,3.81; LV3 -5.08,-3.81; LV4 -5.08,-6.35
1X15_LOCK_LONGPADS = drill 1.016 long: 1 0,0.127; 2 2.54,-0.127; 3 5.08,0.127; 4 7.62,-0.127; 5 10.16,0.127; 6 12.7,-0.127; 7 15.24,0.127; 8 17.78,-0.127; 9 20.32,0.127; 10 22.86,-0.127; 11 25.4,0.127; 12 27.94,-0.127; 13 30.48,0.127; 14 33.02,-0.127; 15 35.56,0.127
1X02 = drill 1.016 pad 1.88: 1 0,0; 2 2.54,0
DEANS = drill 1.27 pad 3.556 long: + 0,0; - 0.737,-6.921
2X20_SHROUDED = drill 1.016 pad 1.88: 1 -1.27,24.13; 2 1.27,24.13; 3 -1.27,21.59; 4 1.27,21.59; 5 -1.27,19.05; 6 1.27,19.05; 7 -1.27,16.51; 8 1.27,16.51; 9 -1.27,13.97; 10 1.27,13.97; 11 -1.27,11.43; 12 1.27,11.43; 13 -1.27,8.89; 14 1.27,8.89; 15 -1.27,6.35; 16 1.27,6.35; 17 -1.27,3.81; 18 1.27,3.81; 19 -1.27,1.27; 20 1.27,1.27; 21 -1.27,-1.27; 22 1.27,-1.27; 23 -1.27,-3.81; 24 1.27,-3.81; 25 -1.27,-6.35; 26 1.27,-6.35; 27 -1.27,-8.89; 28 1.27,-8.89; 29 -1.27,-11.43; 30 1.27,-11.43; 31 -1.27,-13.97; 32 1.27,-13.97; 33 -1.27,-16.51; 34 1.27,-16.51; 35 -1.27,-19.05; 36 1.27,-19.05; 37 -1.27,-21.59; 38 1.27,-21.59; 39 -1.27,-24.13; 40 1.27,-24.13
2X3 = drill 1.016 pad 1.88: 1 0,0; 2 0,2.54; 3 2.54,0; 4 2.54,2.54; 5 5.08,0; 6 5.08,2.54
2X4 = drill 1.016 pad 1.88: 1 -3.81,-1.27; 2 -3.81,1.27; 3 -1.27,-1.27; 4 -1.27,1.27; 5 1.27,-1.27; 6 1.27,1.27; 7 3.81,-1.27; 8 3.81,1.27
BUZZER-12MM-KIT = drill 0.9 pad 1.88: + 3.25,0; - -3.25,0
1X03 = drill 1.016 pad 1.88: 1 0,0; 2 2.54,0; 3 5.08,0
SWITCH_SPDT_PTH_11.6X4.0MM_LOCK = drill 1.016 pad 1.88: 1 0,2.718; 2 0,0; 3 0,-2.718
TESTPAD_B1,27 = smd 1.27 x 1.27: TP 0,0
XT60 = drill 5 octagon: + 4.5,0; - 11.5,0

### Placement (x,y rotation side)
B1  28.6,52.1 270 top
B2  67.99,20.95 180 top
J1  94.71,76.32 270 top
J2  14.95,58.76 90 top
J3  14.55,12.21 90 top
J4  70.7,3.3 0 top
J5  91.9,2.9 0 top
J6  96.8,82.4 180 top
J7  95.61,87.09 180 top
J8  75.68,67.32 180 bottom
J9  30.8,16.9 90 top
J10  25.7,16.9 90 top
J11  30.8,24.5 90 top
J12  25.7,24.5 90 top
J13  20.6,16.9 90 top
J14  20.6,24.5 90 top
J15  39.3,24.5 90 top
J16  39.3,16.9 90 top
J17  58.7,17.7 90 top
J18  38.7,78 0 top
J19  38.7,83.1 0 top
J20  28.5,78 0 top
J21  28.5,83.1 0 top
J22  87.6,65.8 90 top
J23  62.2,66.1 90 top
J24  62.3,76.3 90 top
J25  87.5,53 90 top
J26  28.5,72.9 0 top
J27  38.7,72.9 0 top
J28  62.4,86.6 90 top
J29  28.5,67.8 0 top
J30  38.7,67.8 0 top
J31  30.2,57 90 top
J32  25.1,57 90 top
J33  27.6,49.4 0 top
J34  20,57 90 top
LS1  63.09,6.49 180 top
M1  91.67,22.25 0 top
M2  91.67,17.17 0 top
M3  91.67,12.09 0 top
M4  91.67,7.01 0 top
M5  91.67,32.41 0 top
M6  91.67,27.33 0 top
S1  81.19,3.52 90 top
TP1  2.3,28 0 top
TP2  2.3,25.4 0 top
TP3  2.2,22.9 0 top
TP4  2.3,20.3 0 top
TP5  2.2,17.9 0 top
TP6  2.3,15.2 0 top
TP7  2.3,12.7 0 top
TP8  2.4,10.2 0 top
TP9  2.1,50.9 0 top
TP10  2.2,48.4 0 top
TP11  32.4,9.7 270 top
TP12  32.5,3.2 270 top
TP13  29.8,9.7 270 top
TP14  30,3.1 270 top
TP15  27.2,9.8 270 top
TP16  27.3,3.1 270 top
TP17  24.7,9.7 270 top
TP18  24.8,3.1 270 top
TP19  22.2,9.7 270 top
TP20  22.2,3.2 270 top
TP21  19.7,9.7 270 top
TP22  19.8,3.1 270 top
TP23  17.2,9.7 270 top
TP24  17.2,3.1 270 top
TP25  14.7,9.7 270 top
TP26  14.6,3.1 270 top
TP27  56.2,33 270 top
TP28  56.1,30.6 270 top
TP29  56.1,28 270 top
TP30  56,25.7 270 top
TP31  55.1,22.7 270 top
TP32  55.1,20.4 270 top
TP33  79,73.7 0 top
TP34  79.3,71.1 0 top
TP35  71.9,66 0 top
TP36  71.9,68.6 0 top
TP37  72,71.1 0 top
TP38  79.2,50.7 0 top
TP39  79.1,53.3 0 top
TP40  79.2,55.7 0 top
TP41  72.1,61 0 top
TP42  78.9,61 0 top
TP43  78.9,63.5 0 top
TP44  79.2,68.6 0 top
TP45  72.1,58.5 0 top
TP46  72.1,88.9 0 top
TP47  79.1,91.4 0 top
TP48  79.1,88.9 0 top
TP49  72.1,86.4 0 top
TP50  79.1,86.4 0 top
TP51  72.1,83.8 0 top
TP52  79,81.3 0 top
TP53  71.9,81.2 0 top
TP54  71.8,78.7 0 top
TP55  48.5,43.4 180 top
TP56  48.4,45.7 180 top
TP57  48.4,48.2 180 top
TP58  48.3,50.7 180 top
TP59  48.3,53.2 180 top
TP60  48.3,55.7 180 top
TP61  47.4,60 180 top
TP62  47.5,62.5 180 top
TP63  47.5,65 180 top
TP64  47.5,67.2 180 top
TP65  55.6,40.8 180 top
TP66  55.7,38.1 180 top
U$1  85.7,83.7 90 top

### Tracks (layer width: path | path; a pad name or v marks a point on that pad's centre or on a via)
3.3V  (via drill 0.35)
  Top 0.305: J8.1 74.11,43.19 70.49,46.81 v64.99,46.81
  Bottom 0.305: B2.LV 71.57,21.18 71.57,25.8 64.76,32.62 64.76,46.56 v65,46.8 v64.99,46.81 | J8.17 74.43,63.51 75.7,62.24 75.7,44.48 J8.1
3.3V_SCL  (via drill 0.35)
  Top 0.305: v64.1,48.18 v64.11,48.17 74.31,48.17 J8.5
  Bottom 0.305: B2.LV2 71.11,19.1 71.11,25.62 64.3,32.43 64.3,47.2 64.1,47.4 v64.1,48.18
3.3V_SDA  (via drill 0.35)
  Top 0.305: J8.3 72.72,45.73 70.95,47.49 63.51,47.49 63.5,47.5 v63.1,47.1
  Bottom 0.305: B2.LV1 70.51,17.16 70.51,25.46 63.8,32.17 63.8,46.6 63.7,46.7 63.5,46.7 v63.1,47.1
5V
  Top 0.305: 4.57,63.55 B1.5V@0 3.37,63.53 2.8,64.1 2.8,75.3 4.04,76.54 J2.8 | B1.5V@2 52.81,5.26 52.81,7.54 B1.5V@1
  Top 0.61: S1.2 81.19,5.68 81.17,5.61 81.17,6.61 75.57,12.2 64.8,12.2 64.8,19.6 | J3.8 16.18,29.99 19.08,32.89 46.99,32.89 49.4,35.3 60.2,35.3 64.8,30.7 64.8,19.6 | B2.HV 64.72,19.68 64.8,19.6
  Top 0.813: J8.2 J8.4 | J17.6 J17.5 61.97,18.97 62.1,19.1 62.33,19.1 B2.HV
  Top 1.016: B1.5V@1 52.98,7.9 56.3,7.9 60.6,12.2 64.8,12.2
  Bottom 0.305: 52.81,7.77 B1.5V@1 | 94.41,58.52 J1.8 | J3.8 14.62,29.93 11.11,29.93 6.7,34.34 3.95,34.34 3.9,34.4 3.4,34.4 2.4,35.4 2.4,62.4 3.53,63.53 B1.5V@0
  Bottom 0.61: J1.8 92.58,58.54 91.5,57.46 91.5,45.8 91.5,42.8 75.43,26.73 75.43,13.7 74.43,12.7 65.6,12.7 64.31,13.99 64.31,17.72 62.91,19.12 B2.HV
  Bottom 0.813: J8.4 77.02,45.8 91.5,45.8
5V_SCL
  Top 0.305: B1.21 52.76,15.24
  Top 0.813: B2.HV2 62.2,16.43 J17.3 J17.4 56.27,15.27 B1.21
5V_SDA
  Top 0.305: B1.20 52.83,17.71 61.72,17.71 62.39,18.39 63.43,18.39 64.16,17.66 64.16,16.62 62.91,15.38 B2.HV1
  Top 0.813: J17.2 J17.1 62.2,13.89 B2.HV1
6V
  Bottom 1.016: M5.2 M6.2 M1.2 M2.2 M3.2 M4.2 94.21,3.13 J5.2
12V  (via drill 0.35)
  Top 1.016: J3.6 13.56,26.03 13.07,26.03 12.2,26.9 12.2,30.5 | J3.10 14.19,35.07 12.2,33.08 12.2,30.5 | v4.4,30.4 12.1,30.4 12.2,30.5
  Bottom 1.016: J1.10 97.94,53.46 98.98,54.5 98.98,63.52 | 98.98,63.52 98.8,63.7 94.66,63.7 J1.6 | 98.98,82.2 98.98,84.72 96.61,87.09 J7.+ 94.51,88.19 U$1.+ 83,88.2 81.5,89.7 81.5,95.2 77.72,98.98 11.8,98.98 | 98.98,82.2 98.98,63.52 | 15.14,71.46 J2.6 12.84,71.46 11.74,72.56 11.74,80.36 13,81.62 J2.10 12.78,81.62 11.8,82.6 11.8,98.98 | 11.8,98.98 2.5,98.98 1.1,97.58 1.1,32.1 2.8,30.4 v4.4,30.4 | J6.1 98.78,82.4 98.98,82.2
A2  (via drill 0.35)
  Top 0.305: 94.64,50.98 J1.11 96.92,50.92 97.7,51.7 97.7,77.65 96.09,79.26 90.74,79.26 88.9,81.1 88.9,83.1 87.8,84.2 81.7,84.2 80.2,85.7 80.2,92.4 78.8,93.8 20.7,93.8 19.2,92.3 v19.2,88.6 | B1.A2 6.85,45.75 8,46.9 8,73.8 9.5,75.3 18.4,75.3 19.2,76.1 v19.2,78.8
  Bottom 0.305: v19.2,88.6 v19.2,78.8
A3  (via drill 0.35)
  Top 0.305: B1.A3 7.11,43.21 8.5,44.6 8.5,71.6 9.6,72.7 19.4,72.7 20.2,73.5 v20.2,81.2
  Bottom 0.305: J1.5 94.64,66.29 94.29,66.29 93.9,65.9 96.4,65.9 97.2,66.7 97.2,78.2 95.3,80.1 92.95,80.1 88.23,84.81 81.68,84.81 80.31,86.18 80.31,92.19 78.54,93.97 22.87,93.97 20.1,91.2 20.1,81.3 v20.2,81.2
A4
  Top 0.305: B1.A4 1.77,40.67 0.8,41.64 0.8,81.62 3.34,84.16 J2.11
A5
  Top 0.305: B1.A5 7.77,38.13 9,39.36 9,67.7 10.22,68.92 J2.5
A6
  Bottom 0.305: J3.11 14.18,37.85 7.73,37.85 5.47,35.59 B1.A6
A7
  Bottom 0.305: B1.A7 5.85,33.05 9.2,29.7 9.2,24 10.83,22.37 J3.5
BCM4  (via drill 0.35)
  Top 0.305: J8.7 72.81,50.81 70.9,48.9 65.45,48.9 v65.4,48.95
  Bottom 0.305: 65.87,46.73 65.3,46.15 65.3,32.83 73.07,25.06 B2.LV3 | 65.87,46.73 65.98,46.84 | v65.4,48.95 65.87,48.48 65.87,46.73
BCM17  (via drill 0.35)
  Top 0.305: v66.2,49.58 70.68,49.58 72.4,51.3 72.4,55.3 72.99,55.89 J8.11
  Bottom 0.305: B2.LV4 71.57,27.3 65.76,33.11 65.76,45.96 66.44,46.65 66.44,49.34 v66.2,49.58
D2
  Top 0.305: M4.1 87.04,11.64 87.04,26.3 83.46,29.89 66.47,29.89 60.63,35.73 60.63,41.17 58.4,43.4 52.92,43.4 B1.2
  Top 0.813: TP55.TP 52.54,43.4 B1.2
D3
  Top 0.305: B1.3 56.84,45.75 61.09,41.5 61.09,35.92 66.66,30.34 83.7,30.34 87.6,26.44 87.6,14.5 90.01,12.09 M3.1
  Top 0.813: TP56.TP 52.68,45.7 B1.3
D4
  Top 0.305: B1.4 55.01,48.29 61.54,41.76 61.54,36.11 66.85,30.8 83.95,30.8 88.1,26.65 88.1,18.9 89.83,17.17 M2.1
  Top 0.813: TP57.TP 52.64,48.2 B1.4
D5
  Top 0.305: B1.5 53.27,50.83 62,42.1 62,36.3 67,31.3 84.1,31.3 88.57,26.83 88.57,23.55 89.87,22.25 M1.1
  Top 0.813: TP58.TP 52.6,50.7 B1.5
D6  (via drill 0.35)
  Top 0.305: 94.44,48.52 J1.12 93.12,48.38 91.8,49.7 91.8,57.3 90.49,58.61 79.11,58.61 77.64,57.13 73.89,57.13 73.86,57.1 72.8,57.1 71.7,56 71.7,53 70.9,52.2 v66.9,52.2
  Top 0.813: B1.6 52.56,53.2 TP59.TP
  Bottom 0.305: B1.6 66.23,53.37 66.9,52.7 v66.9,52.2
D7  (via drill 0.35)
  Top 0.305: 65.71,58.83 v65.94,58.6 67.27,58.6 67.28,58.61 70.38,58.61 71.45,59.67 78.27,59.67 78.55,59.39 83.89,59.39 83.9,59.4 90.8,59.4 91.9,60.5 91.9,67.9 92.7,68.7 J1.4
  Top 0.813: B1.7 48.51,55.91 TP60.TP
  Bottom 0.305: v65.94,58.6 65.94,57.2 64.65,55.91 B1.7
D8  (via drill 0.35)
  Top 0.305: J2.12 15.28,86.5 v21.2,86.5
  Top 0.813: B1.8 47.43,59.97 TP61.TP
  Bottom 0.305: B1.8 54.83,59.97 55.69,60.83 55.69,79.81 49,86.5 v21.2,86.5
D9  (via drill 0.35)
  Top 0.305: v35.1,64.6 35.08,64.58 16.88,64.58 J2.4
  Top 0.813: B1.9 47.51,62.51 TP62.TP
  Bottom 0.305: 15.1,66.4 J2.4 | v35.1,64.6 49.3,64.6 51.39,62.51 B1.9
D10  (via drill 0.35)
  Top 0.305: TP63.TP 46.7,64.2 37.7,64.2 36.66,63.16 36.66,41.91 31.96,37.22 31.39,37.22 31,37.62 31,38.18 31.48,38.67 v31.48,39.66
  Top 0.813: B1.10 47.55,65.05 TP63.TP
  Bottom 0.305: J3.12 14.89,40.36 30.74,40.36 31.44,39.66 v31.48,39.66
D11  (via drill 0.35)
  Top 0.305: v31.68,37.9 36.2,42.42 36.2,63.4 37.49,64.69 45.13,64.69 48.03,67.59 B1.11
  Top 0.813: B1.11 47.89,67.59 TP64.TP
  Bottom 0.305: J3.4 15.78,19.83 16.6,20.65 16.6,33.5 18.64,35.54 30.91,35.54 31.68,36.31 v31.68,37.9
D12
  Top 0.305: B1.12 56.37,70.13 57.4,69.1 57.4,47.35 62.46,42.29 62.46,36.49 67.19,31.76 84.29,31.76 88.72,27.33 M6.1
D13
  Top 0.305: B1.13 56.43,72.67 57.86,71.24 57.86,47.54 62.91,42.48 62.91,36.68 67.18,32.41 M5.1
D22
  Bottom 0.305: B1.22 50.97,7.65 52.26,8.94 55.15,8.94 58.2,11.99 74.65,11.99 76.14,13.49 76.14,26.48 92.96,43.3 J1.14
D23
  Bottom 0.305: B1.23 51.48,6.41 53.35,6.41 58.44,11.5 74.9,11.5 76.7,13.3 76.7,26.39 92.13,41.83 96.18,41.83 96.71,42.36 96.71,45.16 96.04,45.84 J1.13
D24
  Bottom 0.305: B1.24 47,8.3 47,55.4 48.84,57.24 54.79,57.24 56.6,59.05 56.6,89.45 60.19,93.04 78.11,93.04 79.4,91.75 79.4,85.7 81.2,83.9 87.85,83.9 88.6,83.15 88.6,73.38 90.74,71.24 J1.3
D25
  Bottom 0.305: B1.25 46.35,6.41 46.35,55.4 48.7,57.74 54.64,57.74 56.14,59.24 56.14,89.64 60,93.5 78.3,93.5 79.86,91.94 79.86,85.89 81.39,84.36 88.04,84.36 89.1,83.3 89.1,75.06 90.38,73.78 J1.2
D26
  Bottom 0.305: J2.14 17.18,91.78 18.16,90.8 18.16,64 19,63.16 33.59,63.16 34.56,62.19 34.56,57.41 35.74,56.22 35.84,56.22 35.84,54.43 35.7,54.29 35.7,54.2 35.61,54.2 35.02,53.6 35.02,16.57 42.23,9.35 43.27,9.35 44.98,7.65 B1.26
D27
  Bottom 0.305: B1.27 43.81,6.41 43.81,8.17 43.09,8.89 42.04,8.89 34.56,16.38 34.56,53.79 35.38,54.62 35.38,55.93 34.12,57.2 34.1,57.2 34.1,62 33.4,62.7 18.8,62.7 17.7,63.8 17.7,88.3 16.76,89.24 J2.13
D28  (via drill 0.35)
  Top 0.305: v34.7,54.9 34.7,62.7 33.76,63.64 15.02,63.64 J2.3
  Bottom 0.305: B1.28 42.52,7.77 34.1,16.19 34.1,54.3 v34.7,54.9
D29  (via drill 0.35)
  Top 0.305: v34.02,55.93 34.02,61.88 33.3,62.6 16.38,62.6 J2.2
  Bottom 0.305: v34.02,55.93 34.02,55.03 33.62,54.63 33.62,16.08 33.56,16.08 41.27,8.37 41.27,6.41 B1.29
D30
  Bottom 0.305: B1.30 40.03,8.82 40.14,8.84 33.02,15.96 33.02,40.08 31.27,41.83 18.08,41.83 J3.14
D31
  Bottom 0.305: J3.13 14.92,42.69 16.42,41.19 31.11,41.19 32.46,39.84 32.46,15.77 38.7,9.53 38.7,8.2 38.73,8.17 38.73,6.41 B1.31
D32
  Bottom 0.305: 14.63,17.14 J3.3 15.71,17.29 18.9,14.1 33.4,14.1 37.49,10.01 B1.32
D33
  Bottom 0.305: 14.86,14.63 J3.2 15.3,14.75 16.51,13.54 33.2,13.54 36.2,10.54 36.2,6.4 B1.33 37.26,5.26
GND
  pour Top: -5.08,107.95 109.22,107.95 109.22,-1.27 -5.08,-1.27
  pour Bottom: -8.48,113.09 114.48,113.09 114.48,-6.35 -8.48,-6.35
N$5
  Top 0.305: TP19.TP 22.25,9.65 B1.44
N$6
  Top 0.305: B1.45 22.25,3.25 TP20.TP
N$8
  Top 0.305: TP21.TP B1.46
N$9
  Top 0.305: B1.47 19.71,3.19 TP22.TP
N$11
  Top 0.305: B1.48 17.17,9.67 TP23.TP
N$12
  Top 0.305: B1.49 17.17,3.13 TP24.TP
N$14
  Top 0.305: B1.50 14.63,9.63 TP25.TP
N$15
  Top 0.305: B1.51 14.63,3.13 TP26.TP
N$18
  Top 0.305: LS1.+ 55.15,1.8 13,1.8 11.9,2.9 11.9,4.92 B1.53
N$23
  Top 0.813: J4.2 73.46,3.52 S1.1
N$26
  Top 0.305: B1.A8 4.44,28 TP1.TP
N$27
  Top 0.305: B1.A9 4.44,25.4 TP2.TP
N$28
  Top 0.305: B1.A10 TP3.TP
N$30
  Top 0.305: B1.A11 4.42,20.3 TP4.TP
N$31
  Top 0.305: B1.A12 4.38,17.9 TP5.TP
N$33
  Top 0.305: B1.A13 4.4,15.2 TP6.TP
N$34
  Top 0.305: B1.A14 4.44,12.7 TP7.TP
N$35
  Top 0.305: B2.HV3 53.82,24.76 53.25,24.18 49.98,24.18 34.9,9.1 34.95,9.05 B1.34
N$36
  Top 0.305: B2.HV4 62.28,26.68 52.21,26.68 50.18,24.64 49.8,24.64 33.7,8.55 33.7,7.13 34.95,5.89 B1.35
N$37
  Top 0.305: B1.36 TP11.TP
N$38
  Top 0.305: B1.37 32.41,3.29 TP12.TP
N$39
  Top 0.305: B1.38 29.8,7.72 TP13.TP
N$40
  Top 0.305: B1.39 29.87,3.23 TP14.TP
N$41
  Top 0.305: B1.40 27.2,7.78 TP15.TP
N$42
  Top 0.305: B1.41 27.33,3.13 TP16.TP
N$43
  Top 0.305: TP17.TP 24.7,7.74 B1.42
N$44
  Top 0.305: B1.43 TP18.TP
N$53
  Top 0.305: B1.A15 TP8.TP
N$54
  Top 0.305: B1.A0 4.4,50.9 TP9.TP
N$55
  Top 0.305: B1.A1 4.36,48.4 TP10.TP
N$56
  Top 0.305: B1.14 56.15,33.05 TP27.TP
N$57
  Top 0.305: B1.15 56.01,30.51 TP28.TP
N$58
  Top 0.305: B1.16 56.07,27.97 TP29.TP
N$59
  Top 0.305: B1.17 55.73,25.43 TP30.TP
N$60
  Top 0.305: B1.18 52.92,22.7 TP31.TP
N$61
  Top 0.305: B1.19 52.78,20.4 TP32.TP
N$62
  Top 0.305: J8.26 78.97,73.67 TP33.TP
N$63
  Top 0.305: J8.24 79.27,71.13 TP34.TP
N$64
  Top 0.305: TP35.TP 74.36,66 J8.19
N$65
  Top 0.305: TP36.TP J8.21
N$66
  Top 0.305: TP37.TP 74.38,71.1 J8.23
N$67
  Top 0.305: J8.8 79.09,50.81 TP38.TP
N$68
  Top 0.305: J8.10 79.05,53.35 TP39.TP
N$69
  Top 0.305: J8.12 79.01,55.89 TP40.TP
N$70
  Top 0.305: TP41.TP 74.38,61 J8.15
N$71
  Top 0.305: J8.16 78.87,60.97 TP42.TP
N$72
  Top 0.305: J8.18 TP43.TP
N$73
  Top 0.305: J8.22 TP44.TP
N$74
  Top 0.305: TP45.TP 74.34,58.5 J8.13
N$75
  Top 0.305: TP46.TP J8.37
N$76
  Top 0.305: J8.40 79.05,91.45 TP47.TP
N$77
  Top 0.305: J8.38 TP48.TP
N$78
  Top 0.305: TP49.TP 74.38,86.4 J8.35
N$79
  Top 0.305: J8.36 79.07,86.37 TP50.TP
N$80
  Top 0.305: TP51.TP 74.38,83.8 J8.33
N$81
  Top 0.305: J8.32 TP52.TP
N$82
  Top 0.305: TP53.TP 74.32,81.2 J8.31
N$83
  Top 0.305: TP54.TP 74.36,78.7 J8.29
N$84
  Top 0.813: B1.1 52.86,40.8 TP65.TP
N$85
  Top 0.813: B1.0 55.67,38.13 TP66.TP

### Text on the board
tNames: GND 12V | 3.3v | D13 | D12 | D5 | D4 | D3 | ON OFF | D2 | GND 5V | GND 6V